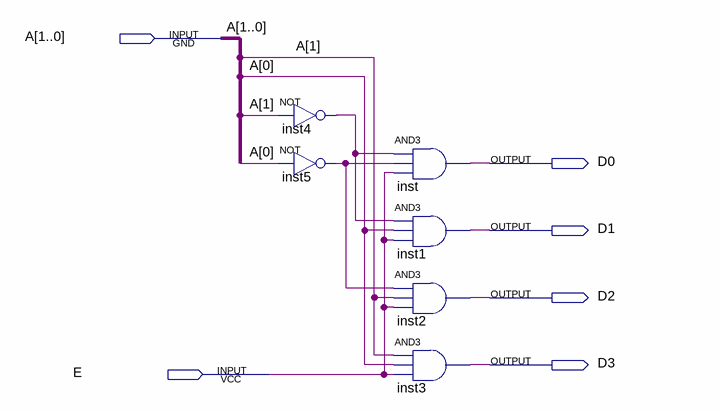
[diagram p0: schematic sheet]
// Quartus schematic dc2_4.bdf as structural Verilog: 6 symbols, 6 pins
module dc2_4 (
  input  [1:0] A,
  input  E,
  output D0,
  output D1,
  output D2,
  output D3
);

  wire inst4_out, inst5_out;

  not inst4 (inst4_out, A[1]);
  not inst5 (inst5_out, A[0]);
  and inst (D0, inst4_out, inst5_out, E);
  and inst1 (D1, inst4_out, A[0], E);
  and inst2 (D2, inst5_out, A[1], E);
  and inst3 (D3, A[1], A[0], E);
endmodule
